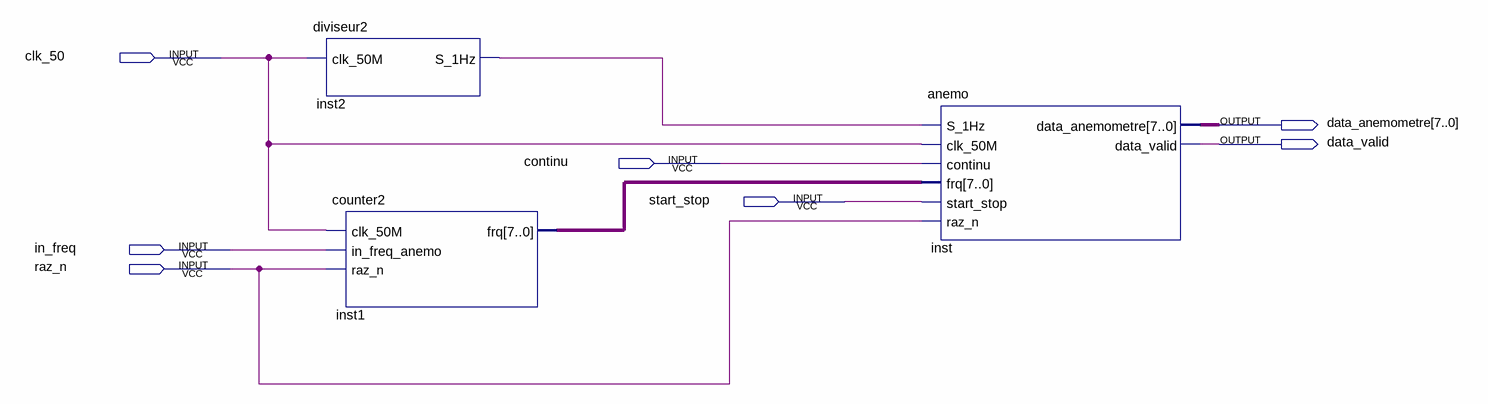
[diagram p0: schematic sheet]
// Quartus schematic anemometre2.bdf as structural Verilog: 3 symbols, 7 pins
module anemometre2 (
  input  clk_50,
  input  continu,
  input  start_stop,
  input  in_freq,
  input  raz_n,
  output [7:0] data_anemometre,
  output data_valid
);

  wire inst2_s_1hz;
  wire [7:0] inst1_frq;

  diviseur2 inst2 (.clk_50M(clk_50), .S_1Hz(inst2_s_1hz));
  counter2 inst1 (.clk_50M(clk_50), .in_freq_anemo(in_freq), .raz_n(raz_n), .frq(inst1_frq));
  anemo inst (
    .S_1Hz(inst2_s_1hz), .clk_50M(clk_50), .continu(continu), .frq(inst1_frq), .start_stop(start_stop),
    .raz_n(raz_n), .data_anemometre(data_anemometre), .data_valid(data_valid));
endmodule
